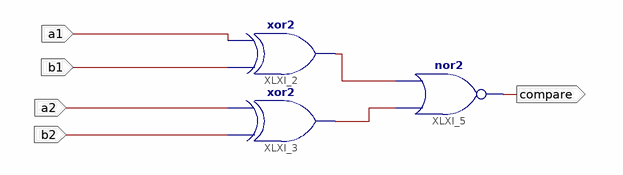
[diagram p0: schematic sheet 1]
// Xilinx ISE schematic comparador.sch (spartan3e) as structural Verilog: 3 symbols, 5 ports
module comparador (
  input  a1,
  input  b1,
  input  a2,
  input  b2,
  output compare
);

  wire XLXN_6, XLXN_7;

  xor XLXI_2 (XLXN_6, b1, a1);
  xor XLXI_3 (XLXN_7, b2, a2);
  nor XLXI_5 (compare, XLXN_7, XLXN_6);
endmodule
